# EAGLE design Pink-Noise-Filter (EAGLE 7.2.0)
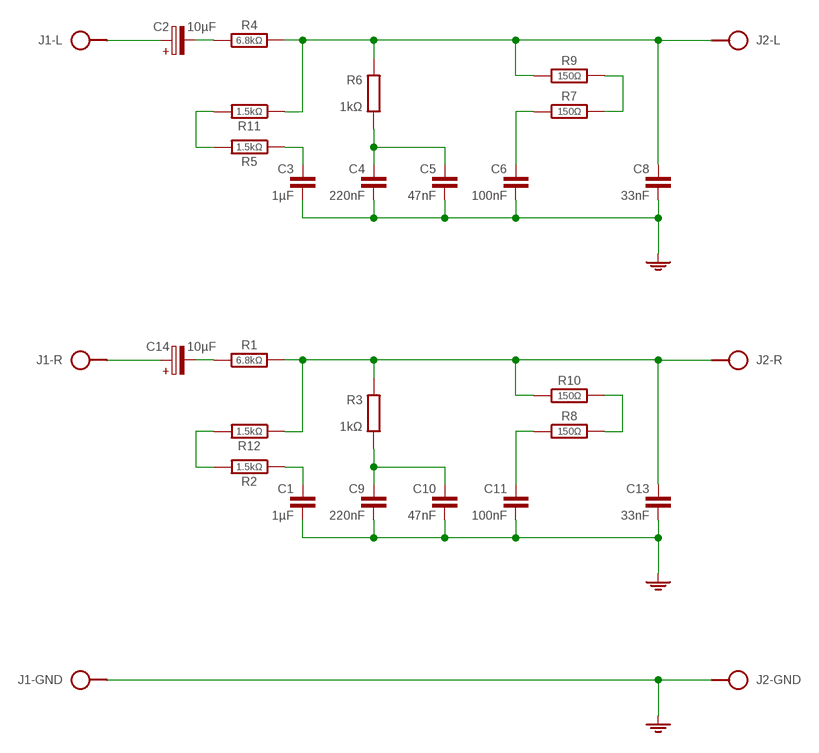
[diagram p0: schematic, sheet 1]

## Parts
C1  1µF  C050-045X075/V  [C050-045X075/V]
C2  10µF  CPOL-HE2,5-5  [E2,5-5]
C3  1µF  C050-045X075/V  [C050-045X075/V]
C4  220nF  C050-024X044/V  [C050-024X044/V]
C5  47nF  C050-020X044/V  [C050-020X044/V]
C6  100nF  C050-020X044/V  [C050-020X044/V]
C8  33nF  C050-020X044/V  [C050-020X044/V]
C9  220nF  C050-024X044/V  [C050-024X044/V]
C10  47nF  C050-020X044/V  [C050-020X044/V]
C11  100nF  C050-020X044/V  [C050-020X044/V]
C13  33nF  C050-020X044/V  [C050-020X044/V]
C14  10µF  CPOL-HE2,5-5  [E2,5-5]
J1  SAUDIOL-GND-R  [SPAD-L-GND-R]
J2  SAUDIOL-GND-R  [SPAD-L-GND-R]
R1  6.8kΩ  R-H0204/10  [0204/10]
R2  1.5kΩ  R-H0204/10  [0204/10]
R3  1kΩ  R0204/10-V  [0204/10-V]
R4  6.8kΩ  R-H0204/10  [0204/10]
R5  1.5kΩ  R-H0204/10  [0204/10]
R6  1kΩ  R0204/10-V  [0204/10-V]
R7  150Ω  R-H0204/10  [0204/10]
R8  150Ω  R-H0204/10  [0204/10]
R9  150Ω  R-H0204/10  [0204/10]
R10  150Ω  R-H0204/10  [0204/10]
R11  1.5kΩ  R-H0204/10  [0204/10]
R12  1.5kΩ  R-H0204/10  [0204/10]

## Nets
GND: C1.2 C3.2 C4.2 C5.2 C6.2 C8.2 C9.2 C10.2 C11.2 C13.2 J1.0 J2.0
N$1: C1.1 R2.1
N$2: C3.1 R5.1
N$3: C4.1 C5.1 R6.2
N$4: C6.1 R7.1
N$5: C8.1 J2.L R4.2 R6.1 R9.1 R11.1
N$6: C2.- R4.1
N$7: C9.1 C10.1 R3.2
N$8: C11.1 R8.1
N$9: C13.1 J2.R R1.2 R3.1 R10.1 R12.1
N$10: C14.- R1.1
N$11: C14.+ J1.R
N$12: C2.+ J1.L
N$13: R7.2 R9.2
N$14: R8.2 R10.2
N$15: R5.2 R11.2
N$16: R2.2 R12.2

## Library data of the parts
C1 C3-C6 C8-C11 C13 = c:C: CAPACITOR, European symbol
C2 C14 = c:CPOL-H
J1 J2 = pad:SAUDIO
R1 R2 R4 R5 R7-R12 = r:R-H
R3 R6 = r:R: RESISTOR, European symbol

## Board
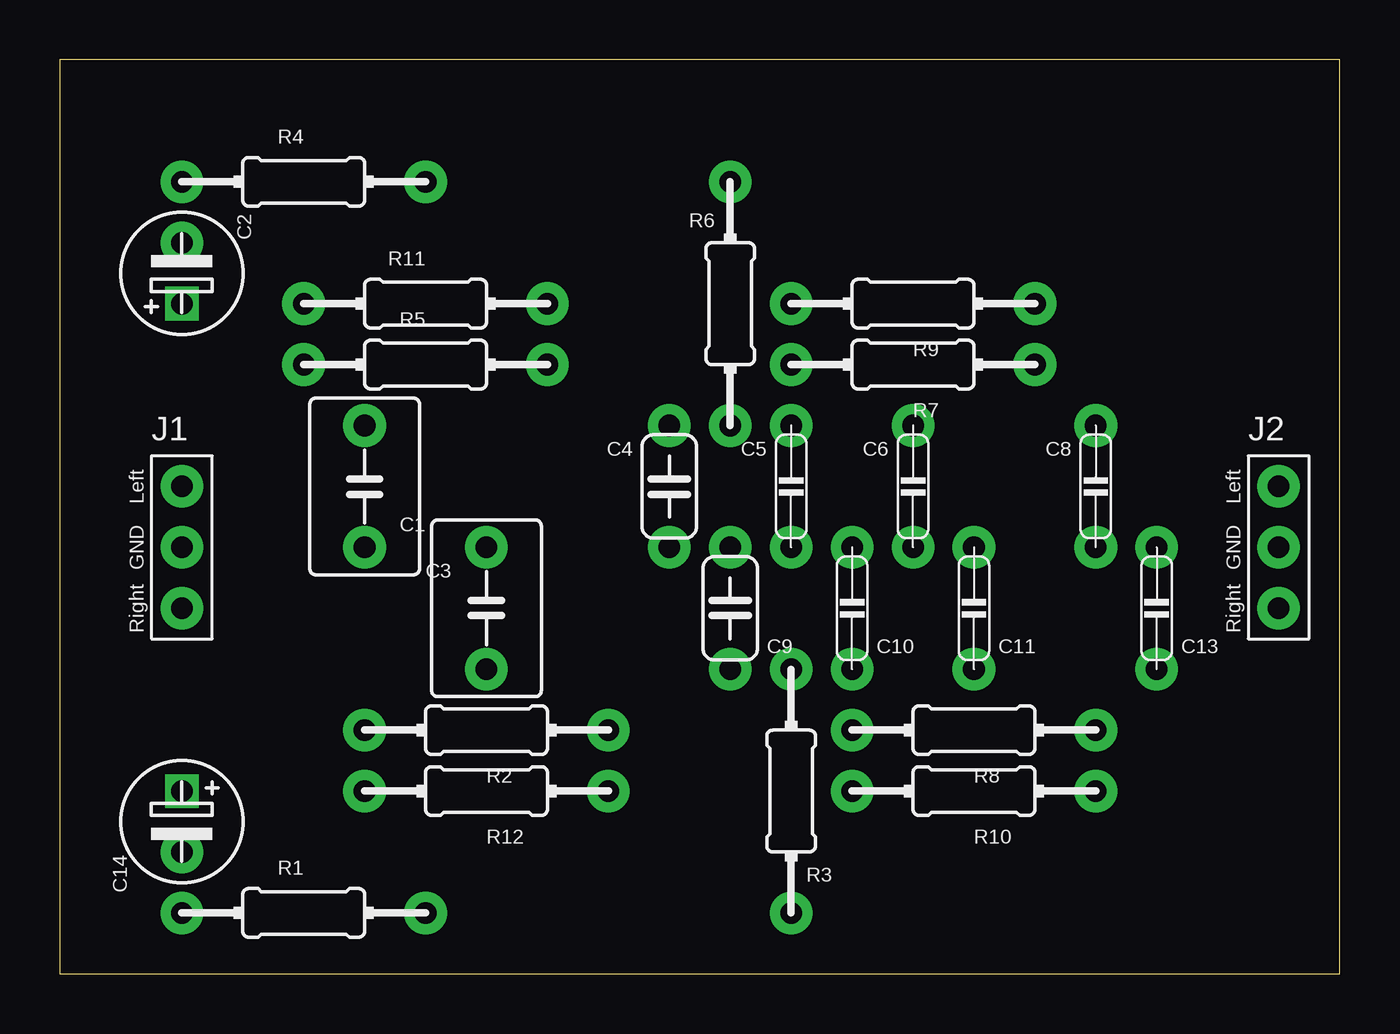
[diagram p1: board, top side]
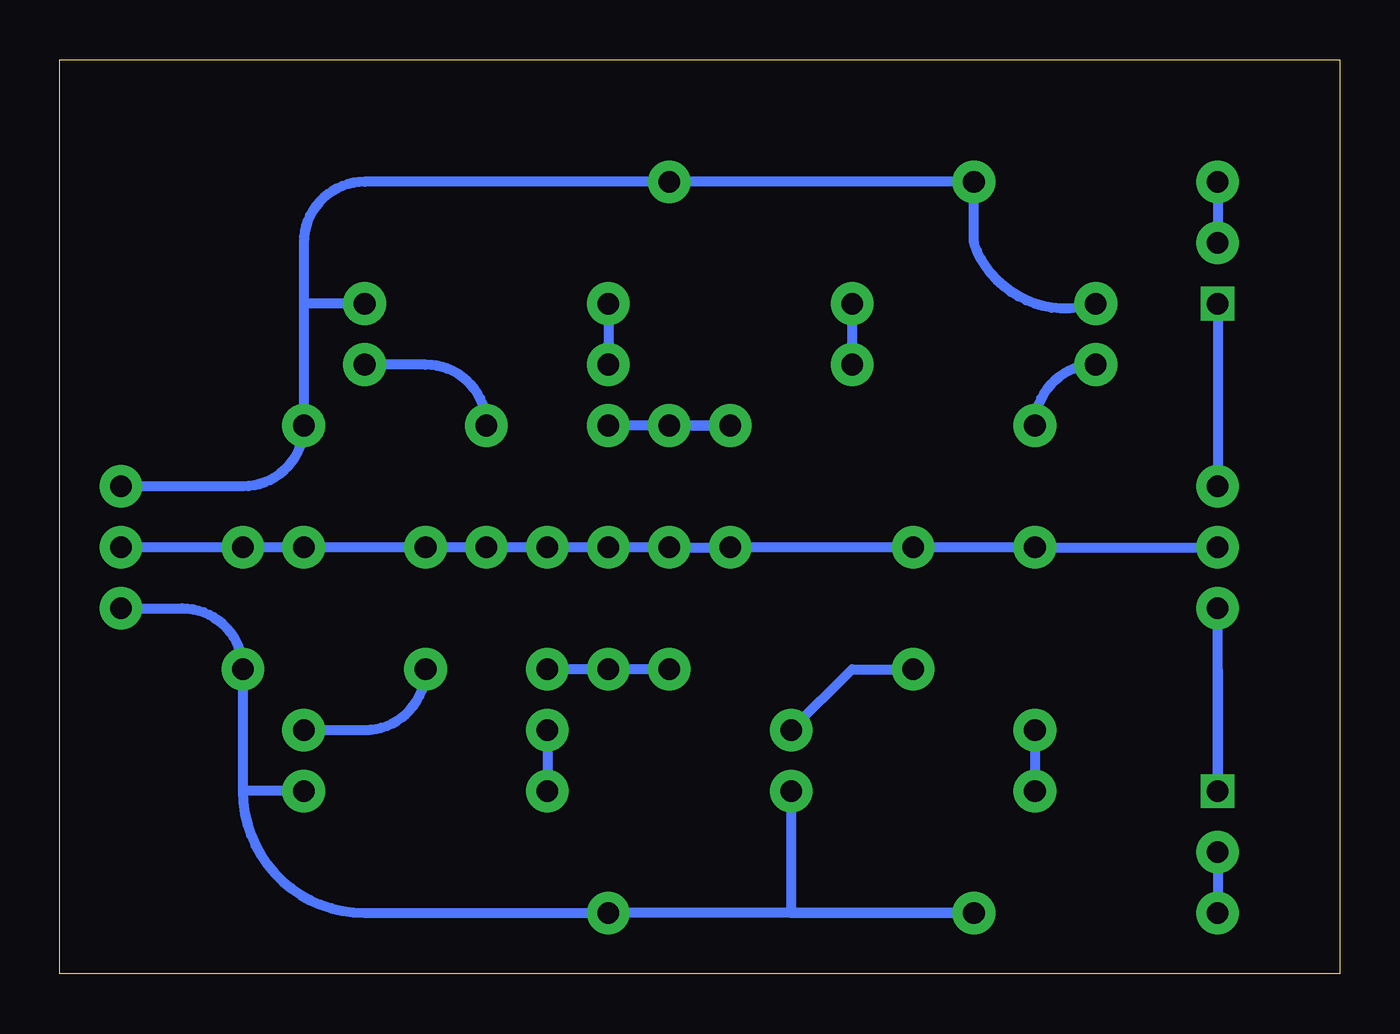
[diagram p2: board, bottom side, seen from below]

Size 53.34 x 38.1 mm. Coordinates in mm from the lower left corner, seen from the top.
Outline: 0,0 53.34,0 53.34,38.1 0,38.1 0,0
Copper layers (1*16): Top 0.035mm / dielectric 1.5mm / Bottom 0.035mm
Design rules "default": minimum track width 10mil, minimum drill 24mil, track to track 8mil, track to pad 8mil, pad to pad 8mil, via to via 8mil, smd to smd 8mil, copper to edge 40mil, drill to drill 8mil, minimum pad ring 10mil, minimum via ring 8mil, stop-mask expansion 4mil, vias tented up to drill 0mil, thermal gap 10mil

### Footprints (pad centres in the part's own frame; a part is rotated, then mirrored left to right if it is on the bottom)
C050-045X075/V = drill 0.9 pad 1.778: 1 0,-2.54; 2 0,2.54
E2,5-5 = drill 0.9 square: + 1.27,0 | drill 0.9 pad 1.778: - -1.27,0
C050-024X044/V = drill 0.9 pad 1.778: 1 0,2.54; 2 0,-2.54
C050-020X044/V = drill 0.9 pad 1.778: 1 0,2.54; 2 0,-2.54
SPAD-L-GND-R = drill 0.9 pad 1.778: 0 0,0; L 0,2.54; R 0,-2.54
0204/10 = drill 0.9 pad 1.778: 1 -5.08,0; 2 5.08,0
0204/10-V = drill 0.9 pad 1.778: 1 0,5.08; 2 0,-5.08

### Placement (x,y rotation side)
C1  17.78,15.24 0 top
C2  5.08,29.21 270 top
C3  12.7,20.32 180 top
C4  25.4,20.32 0 top
C5  30.48,20.32 0 top
C6  35.56,20.32 0 top
C8  43.18,20.32 0 top
C9  27.94,15.24 180 top
C10  33.02,15.24 180 top
C11  38.1,15.24 180 top
C13  45.72,15.24 180 top
C14  5.08,6.35 90 top
J1  5.08,17.78 0 top
J2  50.8,17.78 0 top
R1  10.16,2.54 0 top
R2  17.78,10.16 180 top
R3  30.48,7.62 180 top
R4  10.16,33.02 0 top
R5  15.24,25.4 0 top
R6  27.94,27.94 0 top
R7  35.56,25.4 180 top
R8  38.1,10.16 180 top
R9  35.56,27.94 180 top
R10  38.1,7.62 180 top
R11  15.24,27.94 0 top
R12  17.78,7.62 180 top

### Tracks (layer width: path | path; a pad name or v marks a point on that pad's centre or on a via)
GND
  Bottom 0.406: J2.0 C13.2 C8.2 C11.2 C6.2 C10.2 C5.2 C9.2 C4.2 C1.2 C3.2 J1.0
N$1
  Bottom 0.406: R2.1 20.32,12.7 C1.1
N$2
  Bottom 0.406: R5.1 arc-90 C3.1
N$3
  Bottom 0.406: R6.2 C4.1 C5.1
N$4
  Bottom 0.406: C6.1 arc-90 38.1,25.4 R7.1
N$5
  Bottom 0.406: J2.L 45.72,20.32 arc-90 C8.1 43.18,27.94 | 43.18,27.94 43.18,30.48 arc90 40.64,33.02 R6.1 R4.2 15.24,30.48 arc-90 R11.1 | R9.1 43.18,27.94
N$6
  Bottom 0.406: R4.1 C2.-
N$7
  Bottom 0.406: C9.1 R3.2 C10.1
N$8
  Bottom 0.406: R8.1 40.64,10.16 arc-90 C11.1
N$9
  Bottom 0.406: J2.R 48.26,15.24 arc90 C13.1 45.72,7.62 | R10.1 45.72,7.62 | 45.72,7.62 arc-90 40.64,2.54 R3.1 R1.2 22.86,2.54 R12.1
N$10
  Bottom 0.406: C14.- R1.1
N$11
  Bottom 0.406: 5.08,12.7 C14.+ J1.R
N$12
  Bottom 0.406: C2.+ J1.L
N$13
  Bottom 0.406: R9.2 R7.2
N$14
  Bottom 0.406: R8.2 R10.2
N$15
  Bottom 0.406: R11.2 R5.2
N$16
  Bottom 0.406: R2.2 R12.2

### Text on the board
Document: N | M | L | K | J | I | H | G | F | E | D | C | B | A | 1 | 2 | 3 | 4 | 5 | 6 | 7 | 8 | 9 | 10 | 11 | 12 | 13 | 14 | 15 | 16 | 17 | 18 | 19 | 20